# Altium schematic sheet MotorControl.SchDoc
size A4
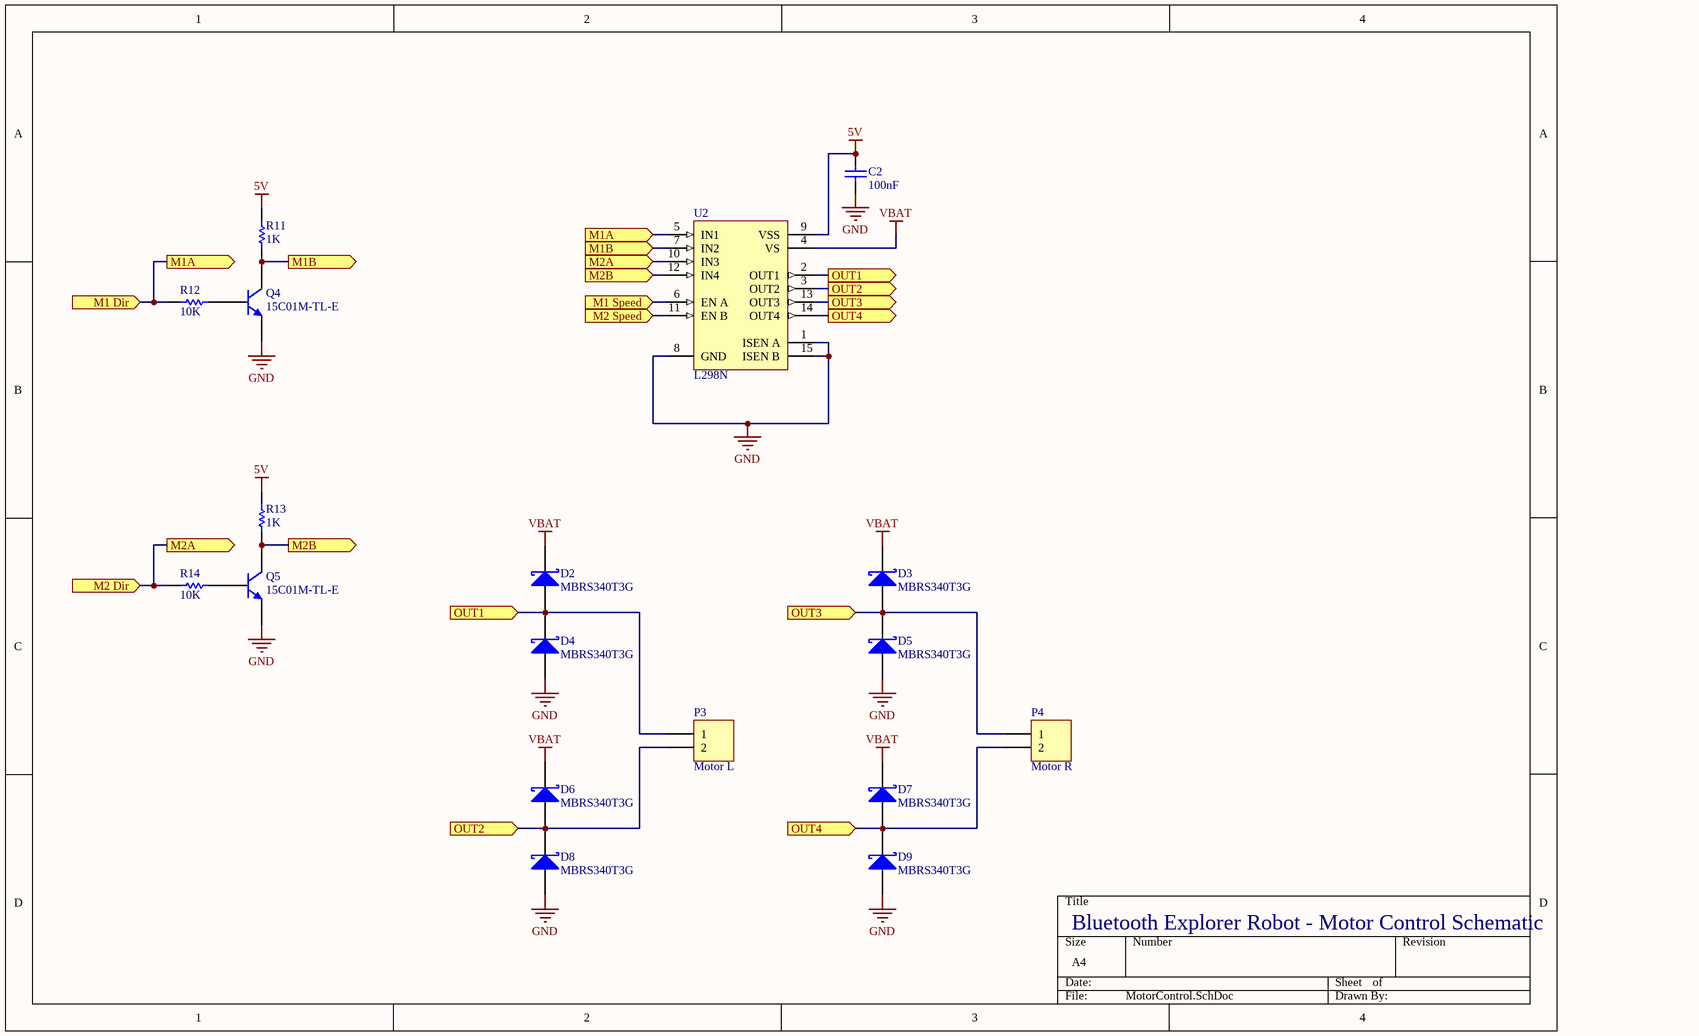
[diagram p0: MotorControl.SchDoc]

## Parts
C2  value 100nF  [0805]
D2  MBRS340T3G  [SMC]
D3  MBRS340T3G  [SMC]
D4  MBRS340T3G  [SMC]
D5  MBRS340T3G  [SMC]
D6  MBRS340T3G  [SMC]
D7  MBRS340T3G  [SMC]
D8  MBRS340T3G  [SMC]
D9  MBRS340T3G  [SMC]
P3  Motor L  [PCB Screw Connector]
P4  Motor R  [PCB Screw Connector]
Q4  15C01M-TL-E  [SOT323]
Q5  15C01M-TL-E  [SOT323]
R11  value 1K  [2012[0805]]  (hidden comment: Res Semi)
R12  value 10K  [2012[0805]]  (hidden comment: Res Semi)
R13  value 1K  [2012[0805]]  (hidden comment: Res Semi)
R14  value 10K  [2012[0805]]  (hidden comment: Res Semi)
U2  L298N  [Multiwatt15V]

## Ports
M1 Dir (in), M1 Speed (in), M1A (in), M1A (out), M1B (in), M1B (out), M2 Dir (in), M2 Speed (in), M2A (in), M2A (out), M2B (in), M2B (out), OUT1 (in), OUT1 (out), OUT2 (in), OUT2 (out), OUT3 (in), OUT3 (out), OUT4 (in), OUT4 (out)

## Nets
5V: C2.1 R11.2 R13.2 U2.9(VSS)
GND: C2.2 D4.1(A) D5.1(A) D8.1(A) D9.1(A) Q4.1(E) Q5.1(E) U2.1(ISEN_A) U2.8(GND) U2.15(ISEN_B)
VBAT: D2.2(K) D3.2(K) D6.2(K) D7.2(K) U2.4(VS)
M1 Dir: R12.2 U2.5(IN1) ; port M1 Dir, port M1A
M1 Speed: U2.6(EN_A) ; port M1 Speed
M1B: Q4.3(C) R11.1 U2.7(IN2) ; port M1B
M2 Dir: R14.2 U2.10(IN3) ; port M2 Dir, port M2A
M2 Speed: U2.11(EN_B) ; port M2 Speed
M2B: Q5.3(C) R13.1 U2.12(IN4) ; port M2B
OUT1: D2.1(A) D4.2(K) P3.1 U2.2(OUT1) ; port OUT1
OUT2: D6.1(A) D8.2(K) P3.2 U2.3(OUT2) ; port OUT2
OUT3: D3.1(A) D5.2(K) P4.1 U2.13(OUT3) ; port OUT3
OUT4: D7.1(A) D9.2(K) P4.2 U2.14(OUT4) ; port OUT4
NetQ4_2: Q4.2(B) R12.1
NetQ5_2: Q5.2(B) R14.1

## Notes on the sheet
- Bluetooth Explorer Robot - Motor Control Schematic

## Library data of the parts
C2 = Cap Semi: Capacitor (Semiconductor SIM Model); Published: 8-Jun-2000; LatestRevisionDate: 17-Jul-2002; LatestRevisionNote: Re-released for DXP Platform.; PackageReference: C1206; Publisher: Altium Limited
D2-D9 = D Schottky: Schottky Diode; Published: 8-Jun-2000; LatestRevisionDate: 17-Jul-2002; LatestRevisionNote: Re-released for DXP Platform.; PackageReference: SMB; Publisher: Altium Limited; Code_JEDEC: DO-214-AA
P3 P4 = Header 2: Header, 2-Pin; LatestRevisionDate: 17-Jul-2002; LatestRevisionNote: Re-released for DXP Platform.; Publisher: Altium Limited
Q4 Q5 = 2N3904: NPN General Purpose Amplifier; Published: 8-Jun-2000; LatestRevisionDate: 15-Jan-2003; LatestRevisionNote: PCB Footprint 'BCY-W3/D4.7' replaced; DatasheetVersion: 1997; PackageVersion: Sep-1998; PackageReference: TO-92A; Publisher: Altium Limited; Code_JEDEC: TO-92A; ComponentLink1Description: Manufacturer Link; ComponentLink1URL: http://www.fairchildsemi.com/; ComponentLink2Description: Datasheet; ComponentLink2URL: http://www.fairchildsemi.com/ds/2N%2F2N3904.pdf
R11-R14 = Res Semi: Semiconductor Resistor; Published: 8-Jun-2000; LatestRevisionDate: 17-Jul-2002; LatestRevisionNote: Re-released for DXP Platform.; PackageReference: AXIAL-0.5; Publisher: Altium Limited
U2 = L298N: Dual Full Bridge Driver; Published: 8-Jun-2000; LatestRevisionDate: 14-May-2007; LatestRevisionNote: Mapped to vertical PCB.; DatasheetVersion: Jul-1999; PackageReference: Multiwatt15V; Publisher: Altium Limited; PackageDescription: TO, Thru-Hole, Vertical, Heatsink Mounted; 15 Bent Staggered Leads; Pitch 1.27 mm; ComponentLink1Description: Manufacturer Link; ComponentLink1URL: http://www.st.com/; ComponentLink2Description: Datasheet; ComponentLink2URL: http://www.st.com/stonline/products/literature/ds/1773/l298.pdf